# EAGLE design BBShield (EAGLE 7.7.0)
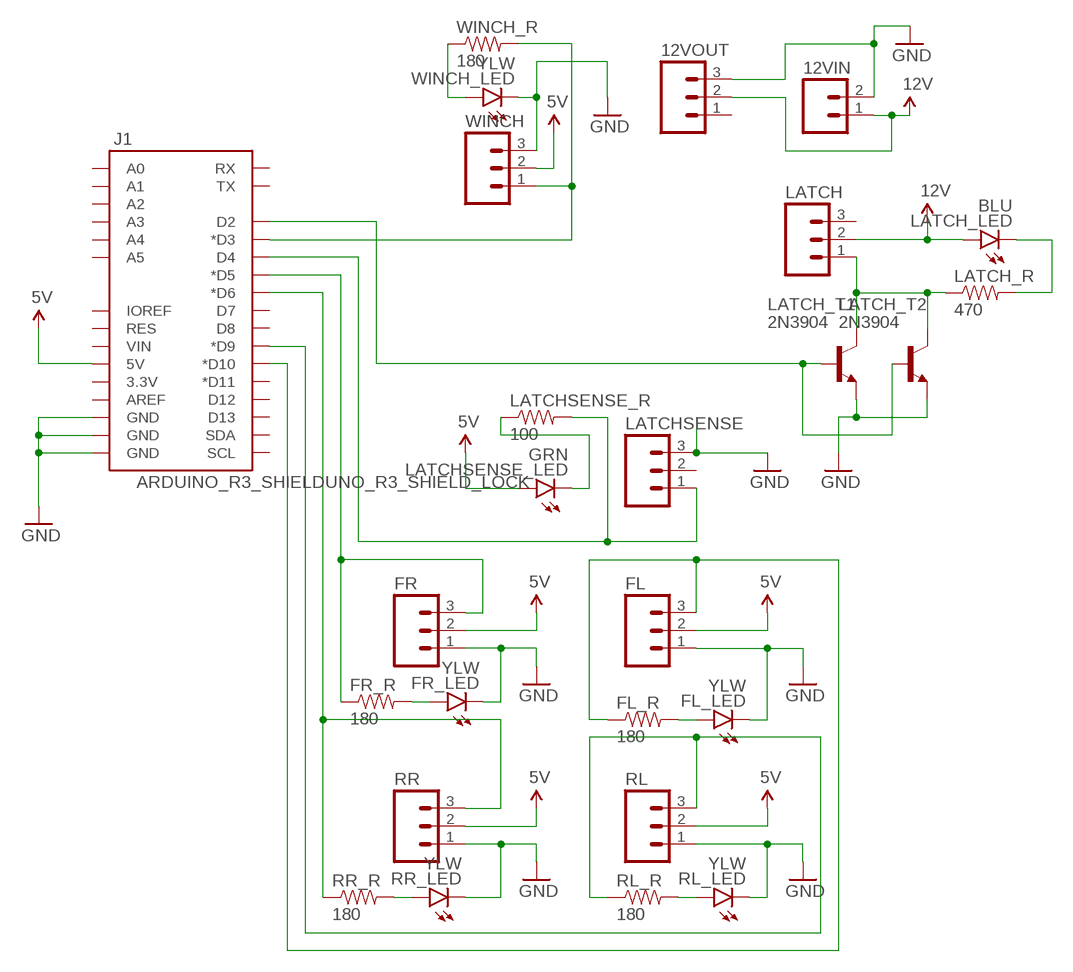
[diagram p0: schematic, sheet 1]

## Parts
12VIN  M025MM  [SCREWTERMINAL-5MM-2]
12VOUT  M03LOCK  [1X03_LOCK]
FL  M03LOCK  [1X03_LOCK]
FL_LED  YLW  LED3MM  [LED3MM]
FL_R  180  RESISTORPTH-1/4W  [AXIAL-0.4]
FR  M03LOCK  [1X03_LOCK]
FR_LED  YLW  LED3MM  [LED3MM]
FR_R  180  RESISTORPTH-1/4W  [AXIAL-0.4]
J1  ARDUINO_R3_SHIELDUNO_R3_SHIELD_LOCK  [UNO_R3_SHIELD_LOCK]
LATCH  M03LOCK  [1X03_LOCK]
LATCH_LED  BLU  LED3MM  [LED3MM]
LATCH_R  470  RESISTORPTH-1/4W  [AXIAL-0.4]
LATCH_T1  2N3904  [TO92]
LATCH_T2  2N3904  [TO92]
LATCHSENSE  M03LOCK  [1X03_LOCK]
LATCHSENSE_LED  GRN  LED3MM  [LED3MM]
LATCHSENSE_R  100  RESISTORPTH-1/4W  [AXIAL-0.4]
RL  M03LOCK  [1X03_LOCK]
RL_LED  YLW  LED3MM  [LED3MM]
RL_R  180  RESISTORPTH-1/4W  [AXIAL-0.4]
RR  M03LOCK  [1X03_LOCK]
RR_LED  YLW  LED3MM  [LED3MM]
RR_R  180  RESISTORPTH-1/4W  [AXIAL-0.4]
WINCH  M03LOCK  [1X03_LOCK]
WINCH_LED  YLW  LED3MM  [LED3MM]
WINCH_R  180  RESISTORPTH-1/4W  [AXIAL-0.4]

## Nets
5V: FL.2 FR.2 J1.5V LATCHSENSE_LED.A RL.2 RR.2 WINCH.2
12V: 12VIN.1 12VOUT.2 LATCH.2 LATCH_LED.A
D2: J1.D2 LATCH_T1.2(B) LATCH_T2.2(B)
D3: J1.D3(*D3) WINCH.1 WINCH_R.P$2
D4: J1.D4 LATCHSENSE.1 LATCHSENSE_R.P$2
D5: FR.3 FR_R.P$1 J1.D5(*D5)
D6: J1.D6(*D6) RR.3 RR_R.P$1
D9: J1.D9(*D9) RL.3 RL_R.P$1
D10: FL.3 FL_R.P$1 J1.D10(*D10)
GND: 12VIN.2 12VOUT.3 FL.1 FL_LED.K(C) FR.1 FR_LED.K(C) J1.GND@0(GND) J1.GND@1(GND) J1.GND@2(GND) LATCH_T1.3(E) LATCH_T2.3(E) LATCHSENSE.3 RL.1 RL_LED.K(C) RR.1 RR_LED.K(C) WINCH.3 WINCH_LED.K(C)
N$1: LATCHSENSE_LED.K(C) LATCHSENSE_R.P$1
N$2: FR_LED.A FR_R.P$2
N$3: WINCH_LED.A WINCH_R.P$1
N$5 [power]: LATCH.1 LATCH_R.P$1 LATCH_T1.1(C) LATCH_T2.1(C)
N$6: RR_LED.A RR_R.P$2
N$8: RL_LED.A RL_R.P$2
N$11: FL_LED.A FL_R.P$2
N$13: LATCH_LED.K(C) LATCH_R.P$2
Unconnected: 12VOUT.1 J1.3.3V J1.A0 J1.A1 J1.A2 J1.A3 J1.A4 J1.A5 J1.AREF J1.D7 J1.D8 J1.D11(*D11) J1.D12 J1.D13 J1.IOREF J1.RES J1.RX J1.SCL J1.SDA J1.TX J1.VIN LATCH.3 LATCHSENSE.2

## Library data of the parts
12VIN = SparkFun-Connectors:M02: Standard 2-pin 0.1" header. Use with - straight break away headers ( PRT-00116) - right angle break away headers (PRT-00553) - swiss pins (PRT-00743) - machine pins (PRT-00117) - female headers (PRT-00115) Molex polarized connector foot print use with: PRT-08233 with associated crimp pins and housings. 2.54_SCREWTERM for use with PRT-10571. 3.5mm Screw Terminal footprints for PRT-08084 5mm Screw Terminal footprints for use with PRT-08432; STOREFRONT_ID: PRT-08432
12VOUT FL FR LATCH LATCHSENSE RL RR WINCH = SparkFun-Connectors:M03: Header 3 Standard 3-pin 0.1" header. Use with straight break away headers (SKU : PRT-00116), right angle break away headers (PRT-00553), swiss pins (PRT-00743), machine pins (PRT-00117), and female headers (PRT-00115). Molex polarized connector foot print use with SKU : PRT-08232 with associated crimp pins and housings.
FL_LED FR_LED LATCH_LED LATCHSENSE_LED RL_LED RR_LED WINCH_LED = SparkFun-LED:LED: LEDs Standard schematic elements and footprints for 5mm, 3mm, 1206, and 0603 sized LEDs. 5mm - Spark Fun Electronics SKU : COM-00529 (and others); PROD_ID: DIO-08794
FL_R FR_R LATCH_R LATCHSENSE_R RL_R RR_R WINCH_R = SparkFun-Passives:RESISTOR: Resistor Basic schematic elements and footprints for 0603, 1206, and PTH resistors.
J1 = SparkFun-Boards:ARDUINO_R3_SHIELD: Shield form compatible with the Arduino Uno R3.
LATCH_T1 LATCH_T2 = transistor-npn:2N3904: NPN Transistor

## Net classes
1 power: width 0.305 mm

## Board
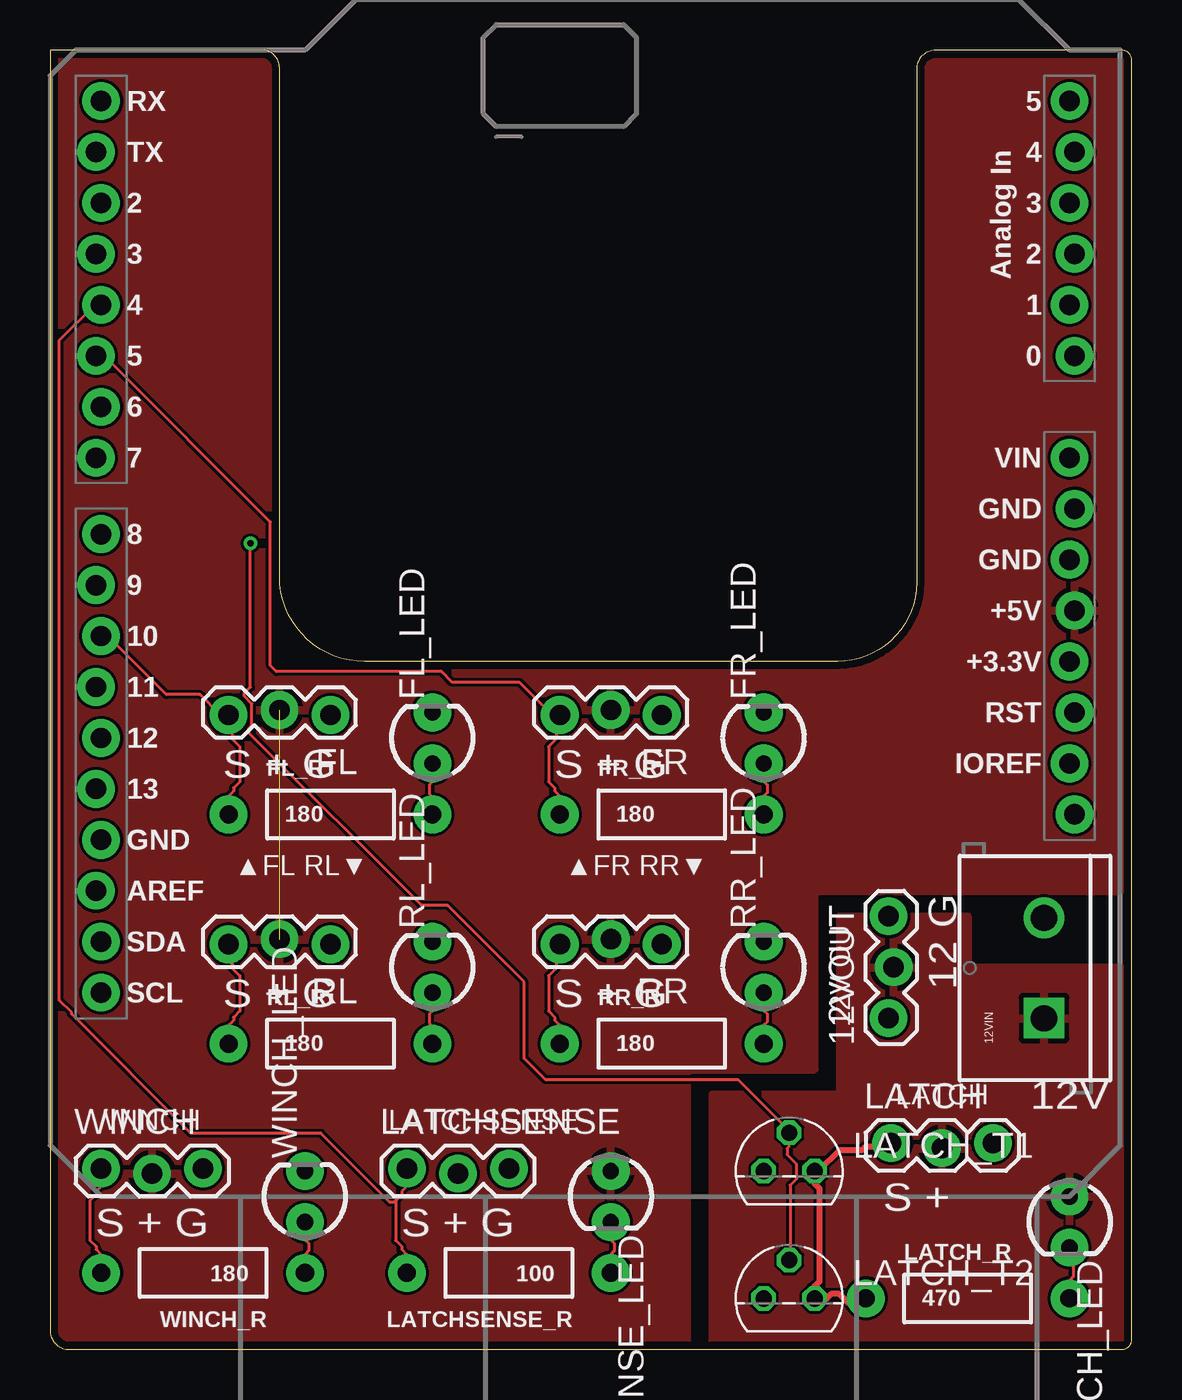
[diagram p1: board, top side]
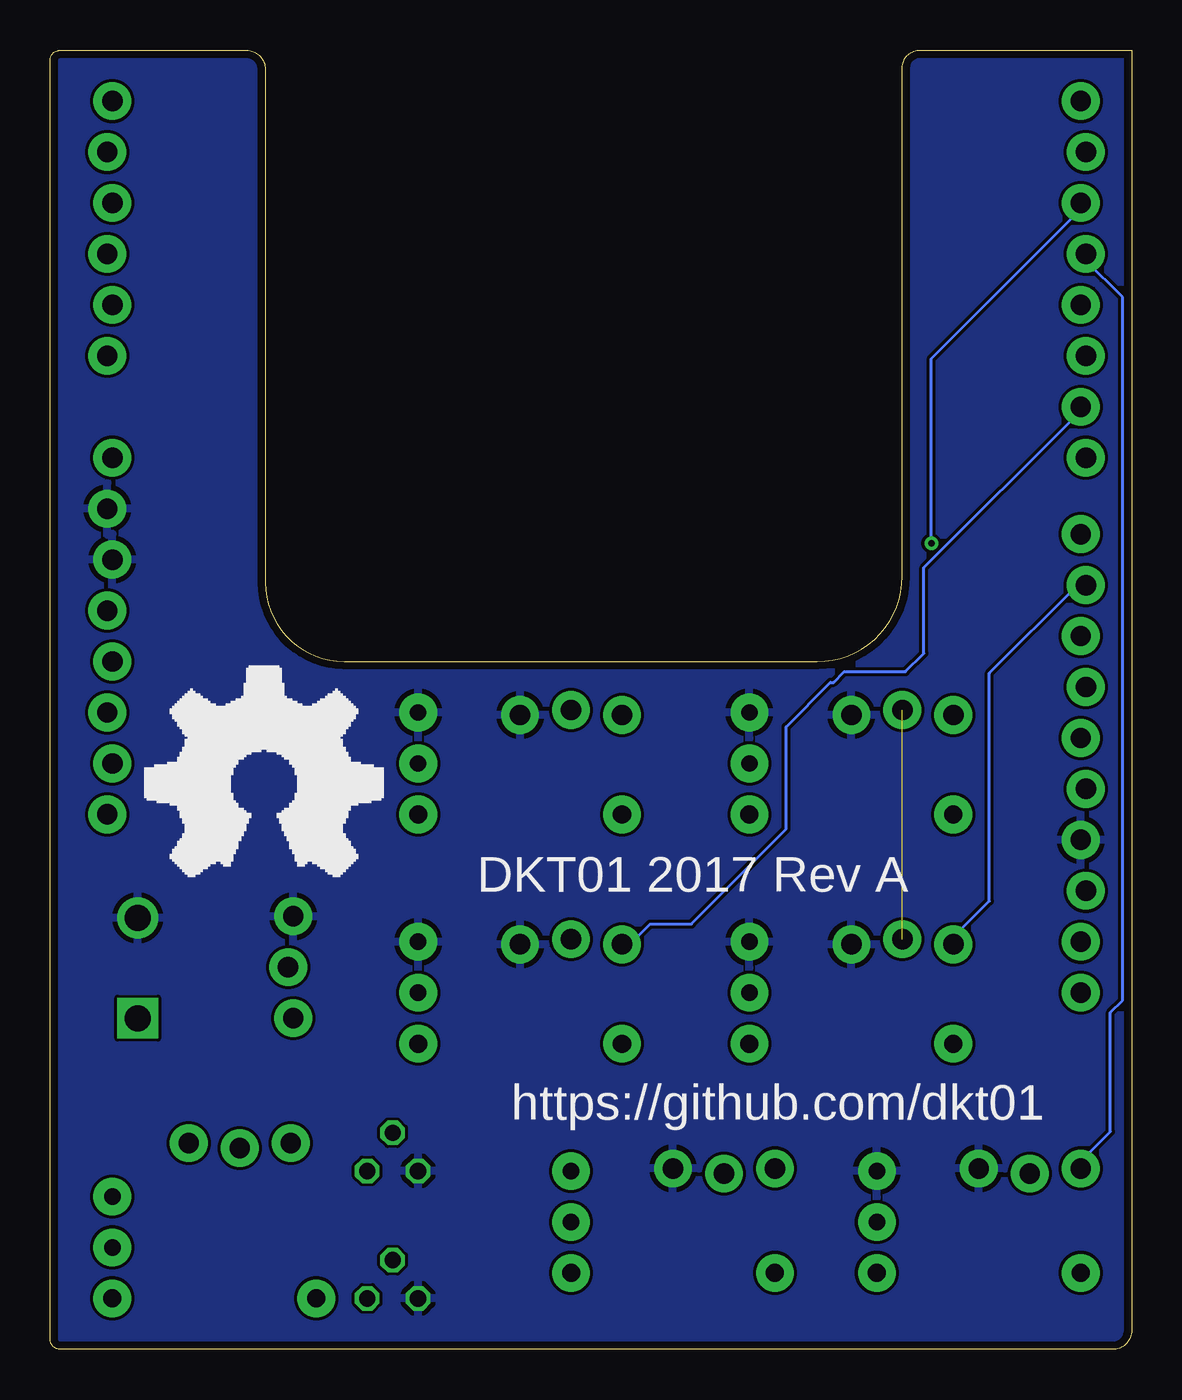
[diagram p2: board, bottom side, seen from below]

Size 53.9 x 64.77 mm. Coordinates in mm from the lower left corner, seen from the top.
Outline: 0,64.76 0,0.94 arc90 0.94,0 53.41,0 arc90 53.9,0.49 53.9,64.28 arc90 53.42,64.76 44.11,64.76 arc90 43.18,63.83 43.18,38.23 arc-90 39.24,34.29 15.68,34.29 arc-90 11.43,38.54 11.43,63.89 arc90 10.55,64.77 0,64.76
Outline: 0,64.77 0,64.76
Copper layers (1*16): Top 0.0356mm / dielectric 1.5011mm / Bottom 0.0356mm
Design rules "oshpark-2layer": minimum track width 6mil, minimum drill 13mil, track to track 6mil, track to pad 6mil, pad to pad 6mil, via to via 6mil, smd to smd 6mil, copper to edge 15mil, drill to drill 6mil, minimum pad ring 7mil, minimum via ring 7mil, stop-mask expansion 2.5mil, vias tented up to drill 0mil, thermal gap 10mil

### Footprints (pad centres in the part's own frame; a part is rotated, then mirrored left to right if it is on the bottom)
SCREWTERMINAL-5MM-2 = drill 1.3 pad 2.032 square: 1 0,0 | drill 1.3 pad 2.032: 2 5,0
1X03_LOCK = drill 1.016 pad 1.88: 1 0,0.127; 2 2.54,-0.127; 3 5.08,0.127
LED3MM = drill 0.813 pad 1.88: A -1.27,0; K 1.27,0
AXIAL-0.4 = drill 0.9 pad 1.88: P$1 -5.08,0; P$2 5.08,0
UNO_R3_SHIELD_LOCK = drill 1.016 pad 1.88: 3.3V 50.8,26.67; 5V 51.054,29.21; A0 51.054,41.91; A1 50.8,44.45; A2 51.054,46.99; A3 50.8,49.53; A4 51.054,52.07; A5 50.8,54.61; AREF 2.286,15.24; D2 2.54,49.53; D3 2.286,46.99; D4 2.54,44.45; D5 2.286,41.91; D6 2.54,39.37; D7 2.286,36.83; D8 2.54,33.02; D9 2.286,30.48; D10 2.54,27.94; D11 2.286,25.4; D12 2.54,22.86; D13 2.286,20.32; GND@0 50.8,31.75; GND@1 51.054,34.29; GND@2 2.54,17.78; IOREF 50.8,21.59; NC 51.054,19.05; RES 51.054,24.13; RX 2.54,54.61; SCL 2.54,10.16; SDA 2.54,12.7; TX 2.286,52.07; VIN 50.8,36.83
TO92 = drill 0.813 octagon: 1 1.27,0; 2 0,1.905; 3 -1.27,0

### Placement (x,y rotation side)
12VIN  49.53,16.51 90 top
12VOUT  41.91,16.51 90 top
FL  13.97,31.75 180 top
FL_LED  19.05,30.48 90 top
FL_R  13.97,26.67 0 top
FR  30.48,31.75 180 top
FR_LED  35.56,30.48 90 top
FR_R  30.48,26.67 0 top
J1  0,7.62 0 top
LATCH  41.91,10.16 0 top
LATCH_LED  50.8,6.35 270 top
LATCH_R  45.72,2.54 0 top
LATCH_T1  36.83,8.89 0 top
LATCH_T2  36.83,2.54 0 top
LATCHSENSE  17.78,8.89 0 top
LATCHSENSE_LED  27.94,7.62 270 top
LATCHSENSE_R  22.86,3.81 180 top
RL  13.97,20.32 180 top
RL_LED  19.05,19.05 90 top
RL_R  13.97,15.24 0 top
RR  30.48,20.32 180 top
RR_LED  35.56,19.05 90 top
RR_R  30.48,15.24 0 top
WINCH  2.54,8.89 0 top
WINCH_LED  12.7,7.62 90 top
WINCH_R  7.62,3.81 180 top

### Tracks (layer width: path | path; a pad name or v marks a point on that pad's centre or on a via)
5V  (1 unrouted)
  pour Top: 53.34,64.77 44.19,64.77 arc90 43.18,63.76 43.18,38.26 arc-90 39.21,34.29 15.59,34.29 arc-90 11.43,38.45 11.43,63.66 arc90 10.32,64.77 0.67,64.77 arc90 0,64.1 0,1.01 arc90 1.01,0 31.75,0 31.75,13.97 38.1,13.97 38.1,22.86 53.34,22.86
12V
  pour Top: 33.02,0 33.02,12.7 39.37,12.7 39.37,21.59 45.72,21.59 45.72,19.05 53.34,19.05 53.34,0
D2  (via drill 0.33)
  Top 0.152: LATCH_T2.2 36.88,4.45 36.88,8.18 37.19,8.48 37.19,9.25 36.73,9.7 36.73,10.01 36.8,10.08 36.8,10.77 LATCH_T1.2 36.88,10.85 34.29,13.44 24.69,13.44 23.62,14.5 23.62,18.31 19.81,22.12 18.52,22.12 9.91,30.73 9.91,30.96 10.06,31.11 10.06,32.18 9.68,32.56 9.68,32.72 9.98,33.02 v9.98,40.18
  Bottom 0.152: v9.98,40.18 9.98,49.4 2.59,56.79 2.59,57.1 J1.D2
D3
  Top 0.152: WINCH_R.P$2 2.52,3.84 2.52,4.75 2.29,4.98 2.29,5.13 1.98,5.44 1.98,7.42 2.29,7.72 2.29,7.87 2.52,8.1 2.52,9.02 WINCH.1
  Bottom 0.152: J1.D3 2.29,54.28 0.46,52.45 0.46,17.4 1.07,16.79 1.07,10.85 2.52,9.4 2.52,9.02 WINCH.1
D4
  Top 0.152: 17.22,7.34 17.22,7.42 17.53,7.72 17.53,7.87 17.75,8.1 17.75,9.02 LATCHSENSE.1 | 17.22,7.34 17.22,5.44 17.53,5.13 17.53,4.98 17.75,4.75 17.75,3.84 LATCHSENSE_R.P$2 | J1.D4 2.21,52.07 0.46,50.32 0.46,17.4 1.07,16.79 1.07,16.71 7.01,10.77 13.49,10.77 16.92,7.34 17.22,7.34
D5
  Top 0.152: J1.D5 2.29,49.48 2.74,49.48 10.97,41.25 10.97,34.09 11.28,33.78 19.51,33.78 20.04,33.25 23.39,33.25 24.99,31.65 25.38,31.65 FR.3 25.38,31.57 25.38,30.81 25.22,30.66 25.22,30.43 24.84,30.05 24.84,28.3 25.15,27.99 25.15,27.84 25.38,27.61 25.38,26.7 FR_R.P$1
D6
  Top 0.152: RR_R.P$1 25.38,15.27 25.38,16.18 25.15,16.41 25.15,16.56 24.84,16.87 24.84,18.62 25.22,19 25.22,19.23 25.38,19.38 25.38,20.14 RR.3
  Bottom 0.152: J1.D6 2.59,46.97 2.59,46.74 10.36,38.96 10.36,34.7 11.28,33.78 14.33,33.78 14.86,33.25 15.01,33.25 17.22,31.04 17.22,25.93 21.95,21.21 24,21.21 24.99,20.22 25.38,20.22 RR.3
D9
  Top 0.152: RL_R.P$1 8.91,15.27 8.91,16.18 9.14,16.41 9.14,16.56 9.45,16.87 9.45,18.62 9.07,19 9.07,19.23 8.91,19.38 8.91,20.14 RL.3
  Bottom 0.152: J1.D9 2.29,38.05 2.74,38.05 7.09,33.71 7.09,22.35 8.84,20.6 8.84,20.22 RL.3
D10
  Top 0.152: FL_R.P$1 8.91,26.7 8.91,27.61 9.14,27.84 9.14,27.99 9.45,28.3 9.45,30.05 9.07,30.43 9.07,30.66 8.91,30.81 8.91,31.57 FL.3 8.84,31.65 8.46,31.65 7.47,32.64 5.79,32.64 2.9,35.53 2.59,35.53 J1.D10
GND
  pour Bottom: 53.34,0 1.02,0 arc-90 0,1.02 0,64.09 arc-90 0.68,64.77 10.37,64.77 arc-90 11.43,63.71 11.43,38.3 arc90 15.44,34.29 39.23,34.29 arc90 43.18,38.24 43.18,63.74 arc-90 44.21,64.77 53.34,64.77
N$1
  Top 0.152: LATCHSENSE_R.P$1 27.96,3.84 27.96,4.75 28.12,4.9 28.12,5.28 27.96,5.44 27.96,6.35 LATCHSENSE_LED.K
N$2
  Top 0.152: FR_R.P$2 35.59,26.7 35.59,27.61 35.74,27.76 35.74,28.14 35.59,28.3 35.59,29.21 FR_LED.A
N$3
  Top 0.152: WINCH_R.P$1 12.72,3.84 12.72,4.75 12.88,4.9 12.88,5.28 12.72,5.44 12.72,6.35 WINCH_LED.A
N$5
  Top 0.305: LATCH_R.P$1 40.01,2.54 39.78,2.31 39.32,2.77 38.94,2.77 38.71,2.54 LATCH_T2.1 38.1,3.15 38.33,3.38 38.33,8.03 38.1,8.25 LATCH_T1.1 38.1,8.94 38.33,8.94 39.32,9.93 40.46,9.93 40.62,10.08 41.76,10.08 41.91,10.24 LATCH.1
N$6
  Top 0.152: RR_R.P$2 35.59,15.27 35.59,16.18 35.74,16.33 35.74,16.71 35.59,16.87 35.59,17.78 RR_LED.A
N$8
  Top 0.152: RL_R.P$2 19.05,16.1 18.9,16.26 18.9,16.71 19.05,16.87 RL_LED.A
N$11
  Top 0.152: FL_R.P$2 19.05,27.53 18.9,27.69 18.9,28.14 19.05,28.3 FL_LED.A
N$13
  Top 0.152: LATCH_R.P$2 50.83,2.54 50.83,3.45 50.98,3.61 50.98,4.14 50.83,4.29 50.83,5.05 LATCH_LED.K

### Text on the board
tPlace: S + G | S + G | ▲FL RL▼ | ▲FR RR▼ | 12 G | 12V OUT | S + G | S + G | LATCH | 12V | WINCH | LATCHSENSE | S + | S + G | S + G
bPlace: DKT01 2017 Rev A | https://github.com/dkt01